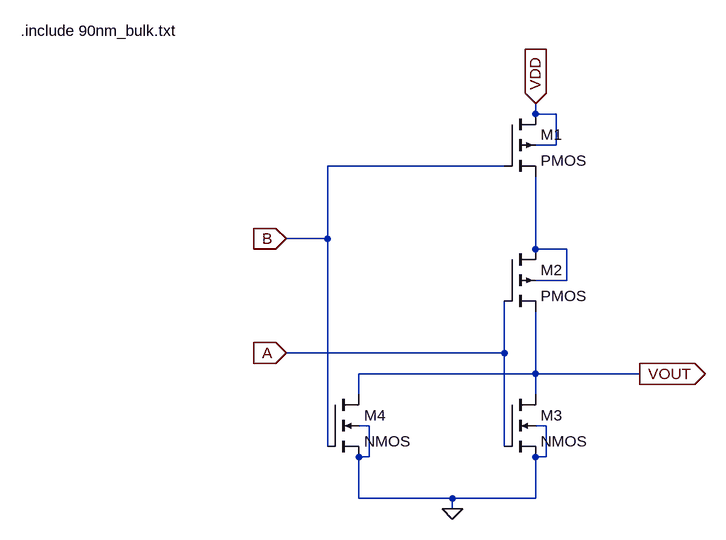
[diagram p0: schematic NOR.asc]
NOR.asc, the LTspice schematic file:
Version 4
SHEET 1 880 680
WIRE -11568 -3200 -11568 -3216
WIRE -11536 -3200 -11568 -3200
WIRE -11536 -3152 -11536 -3200
WIRE -11536 -3152 -11568 -3152
WIRE -11616 -3120 -11888 -3120
WIRE -11888 -3008 -11888 -3120
WIRE -11888 -3008 -11952 -3008
WIRE -11568 -2992 -11568 -3104
WIRE -11520 -2992 -11568 -2992
WIRE -11520 -2944 -11520 -2992
WIRE -11520 -2944 -11568 -2944
WIRE -11616 -2832 -11616 -2912
WIRE -11616 -2832 -11952 -2832
WIRE -11568 -2800 -11568 -2896
WIRE -11568 -2800 -11840 -2800
WIRE -11408 -2800 -11568 -2800
WIRE -11840 -2768 -11840 -2800
WIRE -11568 -2768 -11568 -2800
WIRE -11824 -2720 -11840 -2720
WIRE -11552 -2720 -11568 -2720
WIRE -11888 -2688 -11888 -3008
WIRE -11616 -2688 -11616 -2832
WIRE -11824 -2672 -11824 -2720
WIRE -11824 -2672 -11840 -2672
WIRE -11552 -2672 -11552 -2720
WIRE -11552 -2672 -11568 -2672
WIRE -11840 -2608 -11840 -2672
WIRE -11696 -2608 -11840 -2608
WIRE -11568 -2608 -11568 -2672
WIRE -11568 -2608 -11696 -2608
WIRE -11696 -2592 -11696 -2608
FLAG -11696 -2592 0
FLAG -11408 -2800 VOUT
IOPIN -11408 -2800 Out
FLAG -11952 -2832 A
IOPIN -11952 -2832 In
FLAG -11952 -3008 B
IOPIN -11952 -3008 In
FLAG -11568 -3216 VDD
IOPIN -11568 -3216 In
SYMBOL pmos4 -11616 -3200 R0
SYMATTR InstName M1
SYMATTR Value2 l=90n w=400n
SYMBOL pmos4 -11616 -2992 R0
SYMATTR InstName M2
SYMATTR Value2 l=90n w=400n
SYMBOL nmos4 -11616 -2768 R0
SYMATTR InstName M3
SYMATTR Value2 l=90n w=200n
SYMBOL nmos4 -11888 -2768 R0
SYMATTR InstName M4
SYMATTR Value2 l=90n w=200n
TEXT -12360 -3328 Left 2 !.include 90nm_bulk.txt

The netlist it stands for:
* NOR.asc
M1 VDD B N001 VDD PMOS l=90n w=400n
M2 N001 A VOUT N001 PMOS l=90n w=400n
M3 VOUT A 0 0 NMOS l=90n w=200n
M4 VOUT B 0 0 NMOS l=90n w=200n
.model NMOS NMOS
.model PMOS PMOS
.lib standard.mos
.include 90nm_bulk.txt
.backanno
.end